# EAGLE design Opto-coupler_OM (EAGLE 8.2.2)
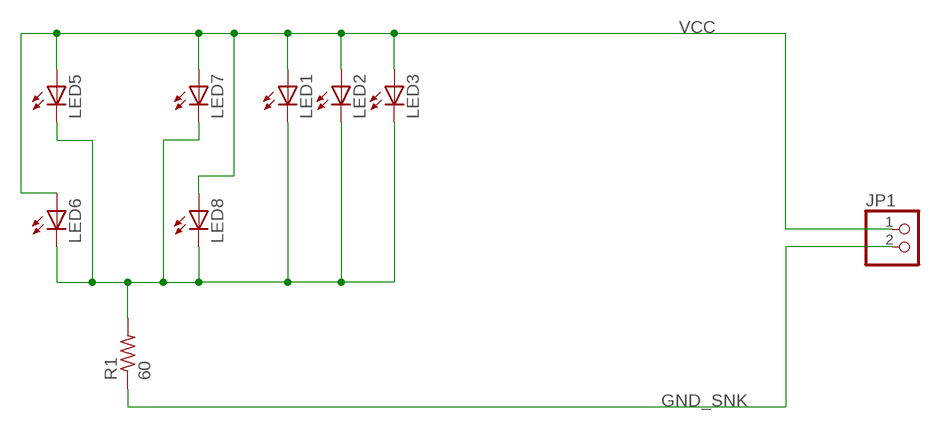
[diagram p0: schematic, sheet 1]

## Parts
JP1  PINHD-1X2  [1X02]
LED1  LED3MM  [LED3MM]
LED2  LED3MM  [LED3MM]
LED3  LED3MM  [LED3MM]
LED5  LED3MM  [LED3MM]
LED6  LED3MM  [LED3MM]
LED7  LED3MM  [LED3MM]
LED8  LED3MM  [LED3MM]
R1  60  R-US_0204/7  [0204/7]

## Nets
GND_SNK: JP1.2 R1.1
N$2: LED1.K(C) LED2.K(C) LED3.K(C) LED5.K(C) LED6.K(C) LED7.K(C) LED8.K(C) R1.2
VCC: JP1.1 LED1.A LED2.A LED3.A LED5.A LED6.A LED7.A LED8.A

## Library data of the parts
JP1 = pinhead:PINHD-1X2: PIN HEADER
LED1-LED3 LED5-LED8 = adafruit:LED: LED OSRAM: - CHIPLED LG R971, LG N971, LY N971, LG Q971, LY Q971, LO R971, LY R971 LH N974, LH R974 LS Q976, LO Q976, LY Q976 LO Q996 - Hyper CHIPLED LW Q18S LB Q993, LB Q99A, LB R99A - SideLED LS A670, LO A670, LY A670, LG A670, LP A670 LB A673, LV A673, LT A673, LW A673 LH A674 LY A675 LS A676, LA A676, LO A676, LY A676, LW A676 LS A679, LY A679, LG A679 - Hyper Micro SIDELED® LS Y876, LA Y876, LO Y876, LY Y876 LT Y87S - SmartLED LW L88C, LW L88S LB L89C, LB L89S, LG L890 LS L89K, LO L89K, LY L89K LS L896, LA L896, LO L896, LY L896 - TOPLED LS T670, LO T670, LY T670, LG T670, LP T670 LSG T670, LSP T670, LSY T670, LOP T670, LYG T670 LG T671, LOG T671, LSG T671 LB T673, LV T673, LT T673, LW T673 LH T674 LS T676, LA T676, LO T676, LY T676, LB T676, LH T676, LSB T676, LW T676 LB T67C, LV T67C, LT T67C, LS T67K, LO T67K, LY T67K, LW E67C LS E67B, LA E67B, LO E67B, LY E67B, LB E67C, LV E67C, LT E67C LW T67C LS T679, LY T679, LG T679 LS T770, LO T770, LY T770, LG T770, LP T770 LB T773, LV T773, LT T773, LW T773 LH T774 LS E675, LA E675, LY E675, LS T675 LS T776, LA T776, LO T776, LY T776, LB T776 LHGB T686 LT T68C, LB T68C - Hyper Mini TOPLED® LB M676 - Mini TOPLED Santana® LG M470 LS M47K, LO M47K, LY M47K Source: http://www.osram.convergy.de/
R1 = adafruit:R-US_: RESISTOR, American symbol

## Board
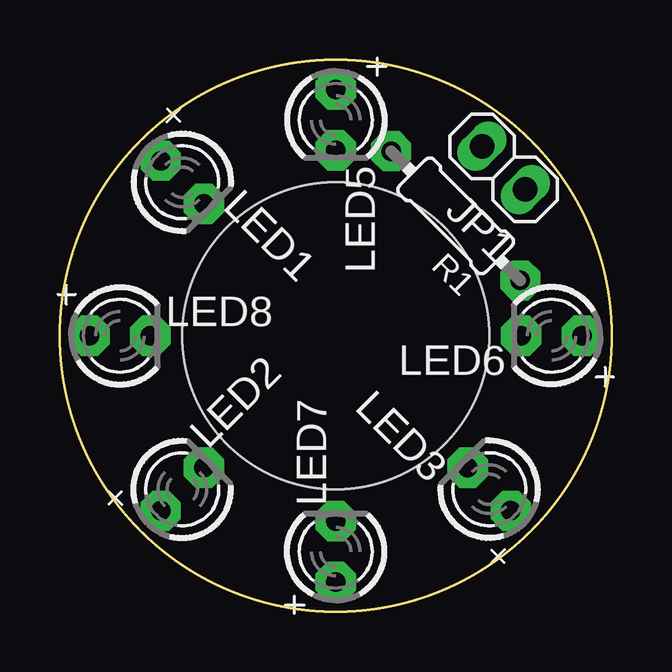
[diagram p1: board, top side]
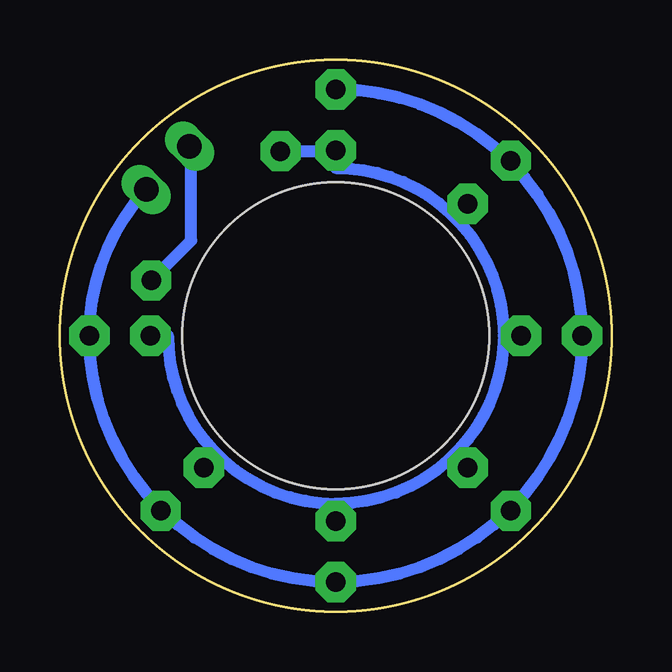
[diagram p2: board, bottom side, seen from below]

Size 23 x 23 mm. Coordinates in mm from the lower left corner, seen from the top.
Outline: circle at 11.5,11.5 radius 11.5
Copper layers (1*16): Top 0.035mm / dielectric 1.5mm / Bottom 0.035mm
Design rules "OthermillDRC_1_64_v2": minimum track width 16mil, minimum drill 31mil, track to track 0.39878125mm, track to pad 0.39878125mm, pad to pad 0.39878125mm, via to via 0.39878125mm, smd to smd 0mil, copper to edge 0mil, drill to drill 1mil, minimum pad ring 0mil, minimum via ring 15mil, stop-mask expansion 1mil, vias tented up to drill 30mil, thermal gap 10mil
Holes 12.8 mm at 11.5,11.5

### Footprints (pad centres in the part's own frame; a part is rotated, then mirrored left to right if it is on the bottom)
1X02 = drill 1.016 long: 1 -1.27,0; 2 1.27,0
LED3MM = drill 0.813 pad 1.676 octagon: A -1.27,0; K 1.27,0
0204/7 = drill 0.813 pad 1.676 octagon: 1 -3.81,0; 2 3.81,0

### Placement (x,y rotation side)
JP1  18.5,18.5 135 top
LED1  5.1,17.9 315 top
LED2  5.1,5.1 45 top
LED3  17.9,5.1 135 top
LED5  11.5,20.5 270 top
LED6  20.5,11.5 180 top
LED7  11.5,2.5 90 top
LED8  2.5,11.5 0 top
R1  16.5,16.5 135 top

### Tracks (layer width: path | path; a pad name or v marks a point on that pad's centre or on a via)
GND_SNK
  Bottom 0.508: R1.1 17.52,15.48 17.52,19.32 JP1.2
N$2
  Bottom 0.406: LED2.K 6.27,6.27 6.27,6.67 6.36,6.75 | 16.64,6.75 16.73,6.67 16.73,6.27 LED3.K | LED1.K 6.27,16.73 6.67,16.73 6.75,16.64
  Bottom 0.508: LED8.K 4.5,11.5 | 11.5,4.5 LED7.K | LED6.K 18.5,11.5 arc-43 16.64,6.75 arc-47 11.5,4.5 | 4.5,11.5 arc-47 6.75,16.64 arc-43 11.5,18.5 LED5.K 11.54,19.19 R1.2 | 4.5,11.5 arc43 6.36,6.75 arc47 11.5,4.5
VCC
  Bottom 0.406: LED2.A 4.24,4.24 4.25,4.25 | 18.75,4.25 18.76,4.24 LED3.A | LED1.A 4.24,18.76 4.25,18.75
  Bottom 0.508: LED5.A arc45 4.24,18.76 arc45 LED8.A arc45 4.24,4.24 arc45 LED7.A arc45 18.76,4.24 arc45 LED6.A arc42 JP1.1